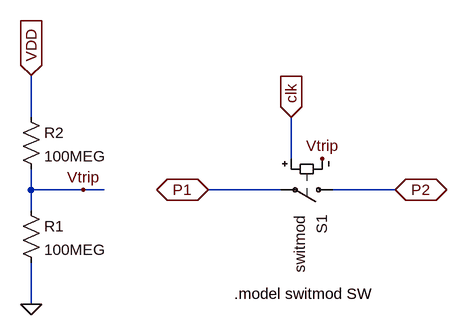
[diagram p0: schematic switch_1.asc]
switch_1.asc, the LTspice schematic file:
Version 4
SHEET 1 2740 696
WIRE 80 -848 80 -912
WIRE 80 -736 80 -768
WIRE 80 -704 80 -736
WIRE 80 -560 80 -624
WIRE 160 -736 80 -736
WIRE 192 -736 160 -736
WIRE 464 -736 352 -736
WIRE 480 -784 480 -848
WIRE 640 -736 544 -736
FLAG 160 -736 Vtrip
FLAG 80 -912 VDD
IOPIN 80 -912 In
FLAG 80 -560 0
FLAG 528 -784 Vtrip
FLAG 640 -736 P2
IOPIN 640 -736 BiDir
FLAG 352 -736 P1
IOPIN 352 -736 BiDir
FLAG 480 -848 clk
IOPIN 480 -848 In
SYMBOL sw 560 -736 R90
WINDOW 3 24 -12 Left 0
WINDOW 38 39 67 Left 0
WINDOW 0 38 33 Left 0
SYMATTR Value ""
SYMATTR SpiceModel switmod
SYMATTR InstName S1
SYMBOL res 64 -720 R0
SYMATTR InstName R1
SYMATTR Value 100MEG
SYMBOL res 64 -864 R0
SYMATTR InstName R2
SYMATTR Value 100MEG
TEXT 392 -576 Left 0 !.model switmod SW

The netlist it stands for:
* switch_1.asc
S1 P2 P1 clk Vtrip switmod
R1 Vtrip 0 100MEG
R2 VDD Vtrip 100MEG
.model switmod SW
.backanno
.end